# Altium schematic sheet lebcube1.SchDoc
size A
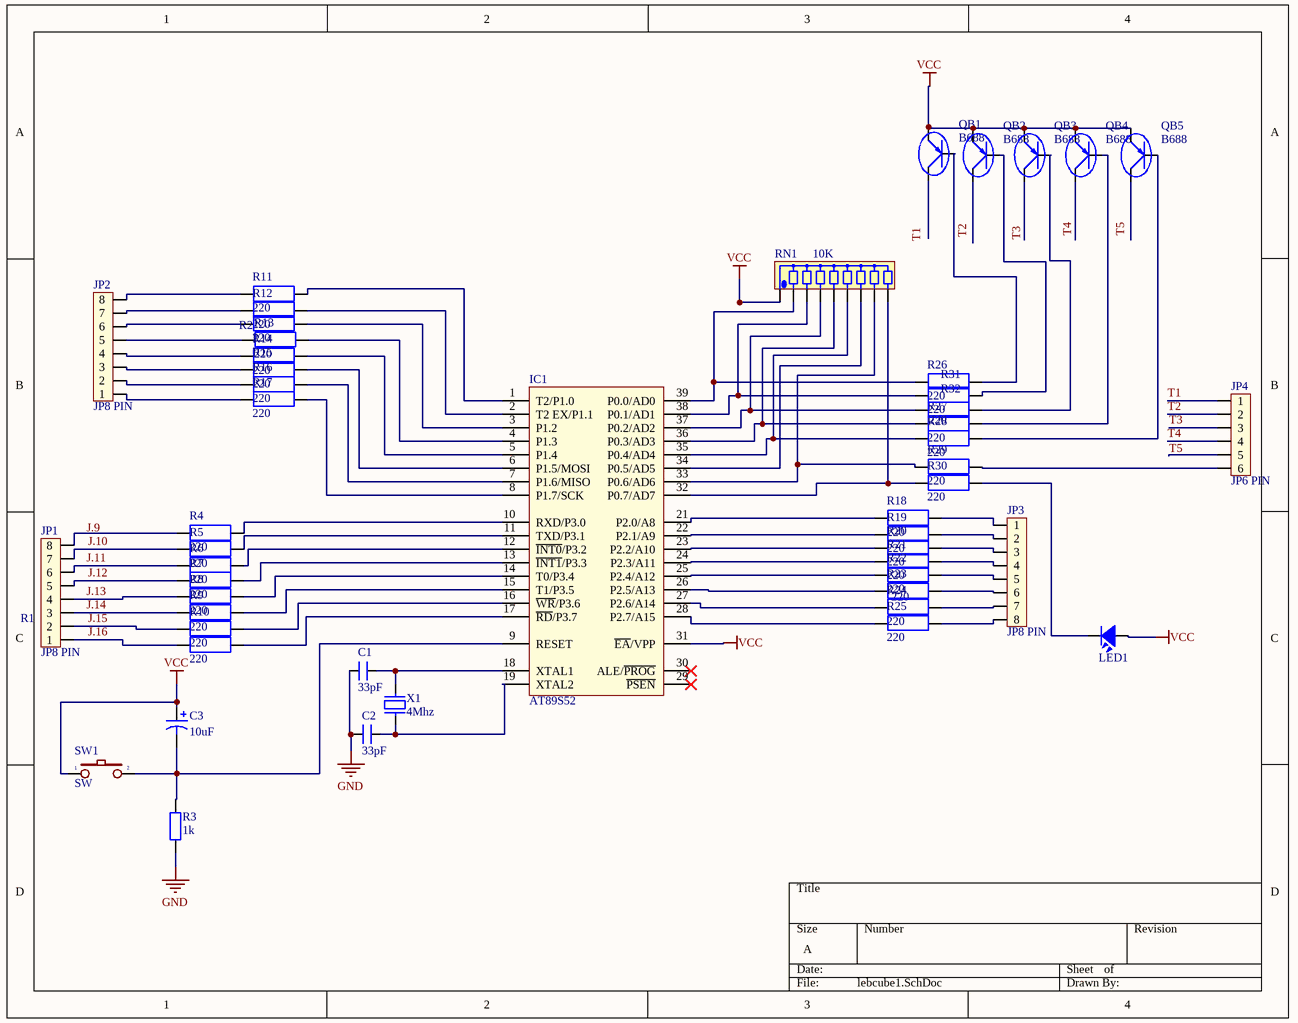
[diagram p0: lebcube1.SchDoc]

## Parts
C1  33pF  [CN1]
C2  33pF  [CN1]
C3  value 10uF  [CP2/5]
IC1  AT89S52  [DIP40/W0.6]
JP1  JP8 PIN  [JP8]
JP2  JP8 PIN  [JP8]
JP3  JP8 PIN  [JP8]
JP4  JP6 PIN  [JP6]
LED1  LED  [LED-3]  (value not drawn)
QB1  B688  [QTO-247]
QB2  B688  [QTO-247]
QB3  B688  [QTO-247]
QB4  B688  [QTO-247]
QB5  B688  [QTO-247]
R1  220  [R1W]
R2  220  [R1W]
R3  1k  [R1/4W]
R4  220  [R1W]
R5  220  [R1W]
R6  220  [R1W]
R7  220  [R1W]
R8  220  [R1W]
R9  220  [R1W]
R10  220  [R1W]
R11  220  [R1W]
R12  220  [R1W]
R13  220  [R1W]
R14  220  [R1W]
R15  220  [R1W]
R16  220  [R1W]
R17  220  [R1W]
R18  220  [R1W]
R19  220  [R1W]
R20  220  [R1W]
R21  220  [R1W]
R22  220  [R1W]
R23  220  [R1W]
R24  220  [R1W]
R25  220  [R1W]
R26  220  [R1W]
R27  220  [R1W]
R28  220  [R1W]
R29  220  [R1W]
R30  220  [R1W]
R31  220  [R1W]
R32  220  [R1W]
RN1  10K  [RN8]
SW1  SW  [SW2]
X1  4Mhz  [XT2]

## Nets
GND: C1.1 C2.1 IC1.20(GND) R3.2
VCC: C3.1 IC1.31(~{EA}/VPP) IC1.40(VCC) LED1.1 QB1.3(E) QB2.3(E) QB3.3(E) QB4.3(E) QB5.3(E) RN1.1 SW1.1
J.10: JP1.7 R5.1
J.11: JP1.6 R6.1
J.12: JP1.5 R7.1
J.13: JP1.4 R8.1
J.14: JP1.3 R9.1
J.15: JP1.2 R10.1
J.16: JP1.1 R1.1
T1: JP4.1
T2: JP4.2
T3: JP4.3 QB3.2(C)
T4: JP4.4 QB4.2(C)
T5: JP4.5
NetC1_2: C1.2 IC1.18(XTAL1) X1.1
NetC2_2: C2.2 IC1.19(XTAL2) X1.2
NetC3_2: C3.2 IC1.9(RESET) R3.1 SW1.2
NetIC1_1: IC1.1(T2/P1.0) R11.2
NetIC1_2: IC1.2(T2_EX/P1.1) R12.2
NetIC1_3: IC1.3(P1.2) R2.2
NetIC1_4: IC1.4(P1.3) R13.2
NetIC1_5: IC1.5(P1.4) R14.2
NetIC1_6: IC1.6(P1.5/MOSI) R15.2
NetIC1_7: IC1.7(P1.6/MISO) R16.2
NetIC1_8: IC1.8(P1.7/SCK) R17.2
NetIC1_10: IC1.10(RXD/P3.0) R4.2
NetIC1_11: IC1.11(TXD/P3.1) R5.2
NetIC1_12: IC1.12(~{INT0}/P3.2) R6.2
NetIC1_13: IC1.13(~{INT1}/P3.3) R7.2
NetIC1_14: IC1.14(T0/P3.4) R8.2
NetIC1_15: IC1.15(T1/P3.5) R9.2
NetIC1_16: IC1.16(~{WR}/P3.6) R10.2
NetIC1_17: IC1.17(~{RD}/P3.7) R1.2
NetIC1_21: IC1.21(P2.0/A8) R18.1
NetIC1_22: IC1.22(P2.1/A9) R19.1
NetIC1_23: IC1.23(P2.2/A10) R20.1
NetIC1_24: IC1.24(P2.3/A11) R21.1
NetIC1_25: IC1.25(P2.4/A12) R22.1
NetIC1_26: IC1.26(P2.5/A13) R23.1
NetIC1_27: IC1.27(P2.6/A14) R24.1
NetIC1_28: IC1.28(P2.7/A15) R25.1
NetIC1_32: IC1.32(P0.7/AD7) R30.1 RN1.9
NetIC1_33: IC1.33(P0.6/AD6) R29.1 RN1.8
NetIC1_34: IC1.34(P0.5/AD5) RN1.7
NetIC1_35: IC1.35(P0.4/AD4) R28.1 RN1.6
NetIC1_36: IC1.36(P0.3/AD3) R27.1 RN1.5
NetIC1_37: IC1.37(P0.2/AD2) R32.1 RN1.4
NetIC1_38: IC1.38(P0.1/AD1) R31.1 RN1.3
NetIC1_39: IC1.39(P0.0/AD0) R26.1 RN1.2
NetJP1_8: JP1.8 R4.1
NetJP2_1: JP2.1 R17.1
NetJP2_2: JP2.2 R16.1
NetJP2_3: JP2.3 R15.1
NetJP2_4: JP2.4 R14.1
NetJP2_5: JP2.5 R13.1
NetJP2_6: JP2.6 R2.1
NetJP2_7: JP2.7 R12.1
NetJP2_8: JP2.8 R11.1
NetJP3_1: JP3.1 R18.2
NetJP3_2: JP3.2 R19.2
NetJP3_3: JP3.3 R20.2
NetJP3_4: JP3.4 R21.2
NetJP3_5: JP3.5 R22.2
NetJP3_6: JP3.6 R23.2
NetJP3_7: JP3.7 R24.2
NetJP3_8: JP3.8 R25.2
NetJP4_6: JP4.6 R29.2
NetLED1_2: LED1.2 R30.2
NetQB1_1: QB1.1(B) R26.2
NetQB2_1: QB2.1(B) R31.2
NetQB3_1: QB3.1(B) R32.2
NetQB4_1: QB4.1(B) R27.2
NetQB5_1: QB5.1(B) R28.2

Not connected (* = marked no-connect by the designer): IC1 29(~{PSEN})* 30(ALE/~{PROG})*; QB1 2(C); QB2 2(C); QB5 2(C)

## Notes on the sheet
- Labels drawn without touching a wire or pin: J.9, T1, T2, T5

## Library data of the parts
C1 C2 = CN1: Cap np  1pF - 472pF; Value: 100pF
C3 = Cap Pol3: Polarized Capacitor (Surface Mount); VALUE: C?; LatestRevisionDate: 17-Jul-2002; LatestRevisionNote: Re-released for DXP Platform.; PackageReference: C0805; Publisher: Altium Limited
IC1 = AT89S52: AT89S52, 8k Byte Flash Memory , 40 Pin; Value: AT89S52
JP1-JP3 = JP8: Value: JP7
JP4 = JP6: Value: JP7
LED1 = LED: LED Single colour Green and Red; Value: LED 3 ly Single Colour
QB1-QB5 = B688: Transistor Power Supply; Value: B688
R1 R2 R4-R32 = R1W: Resistor 1W; Value: R1W - 100
R3 = R1/4W: Resistor 1/4W; Value: R1/4W - 1K
RN1 = RN8: Resistor 8 (Thanh); Value: Tro thanh 10K
SW1 = SW2: Switch button 2 pin; Value: SW chip 2 pin
X1 = XT2: Crystal For all Crystal 2pin.; Value: 4Mhz